# EAGLE design canbus_shield-v1 (EAGLE 6.2)
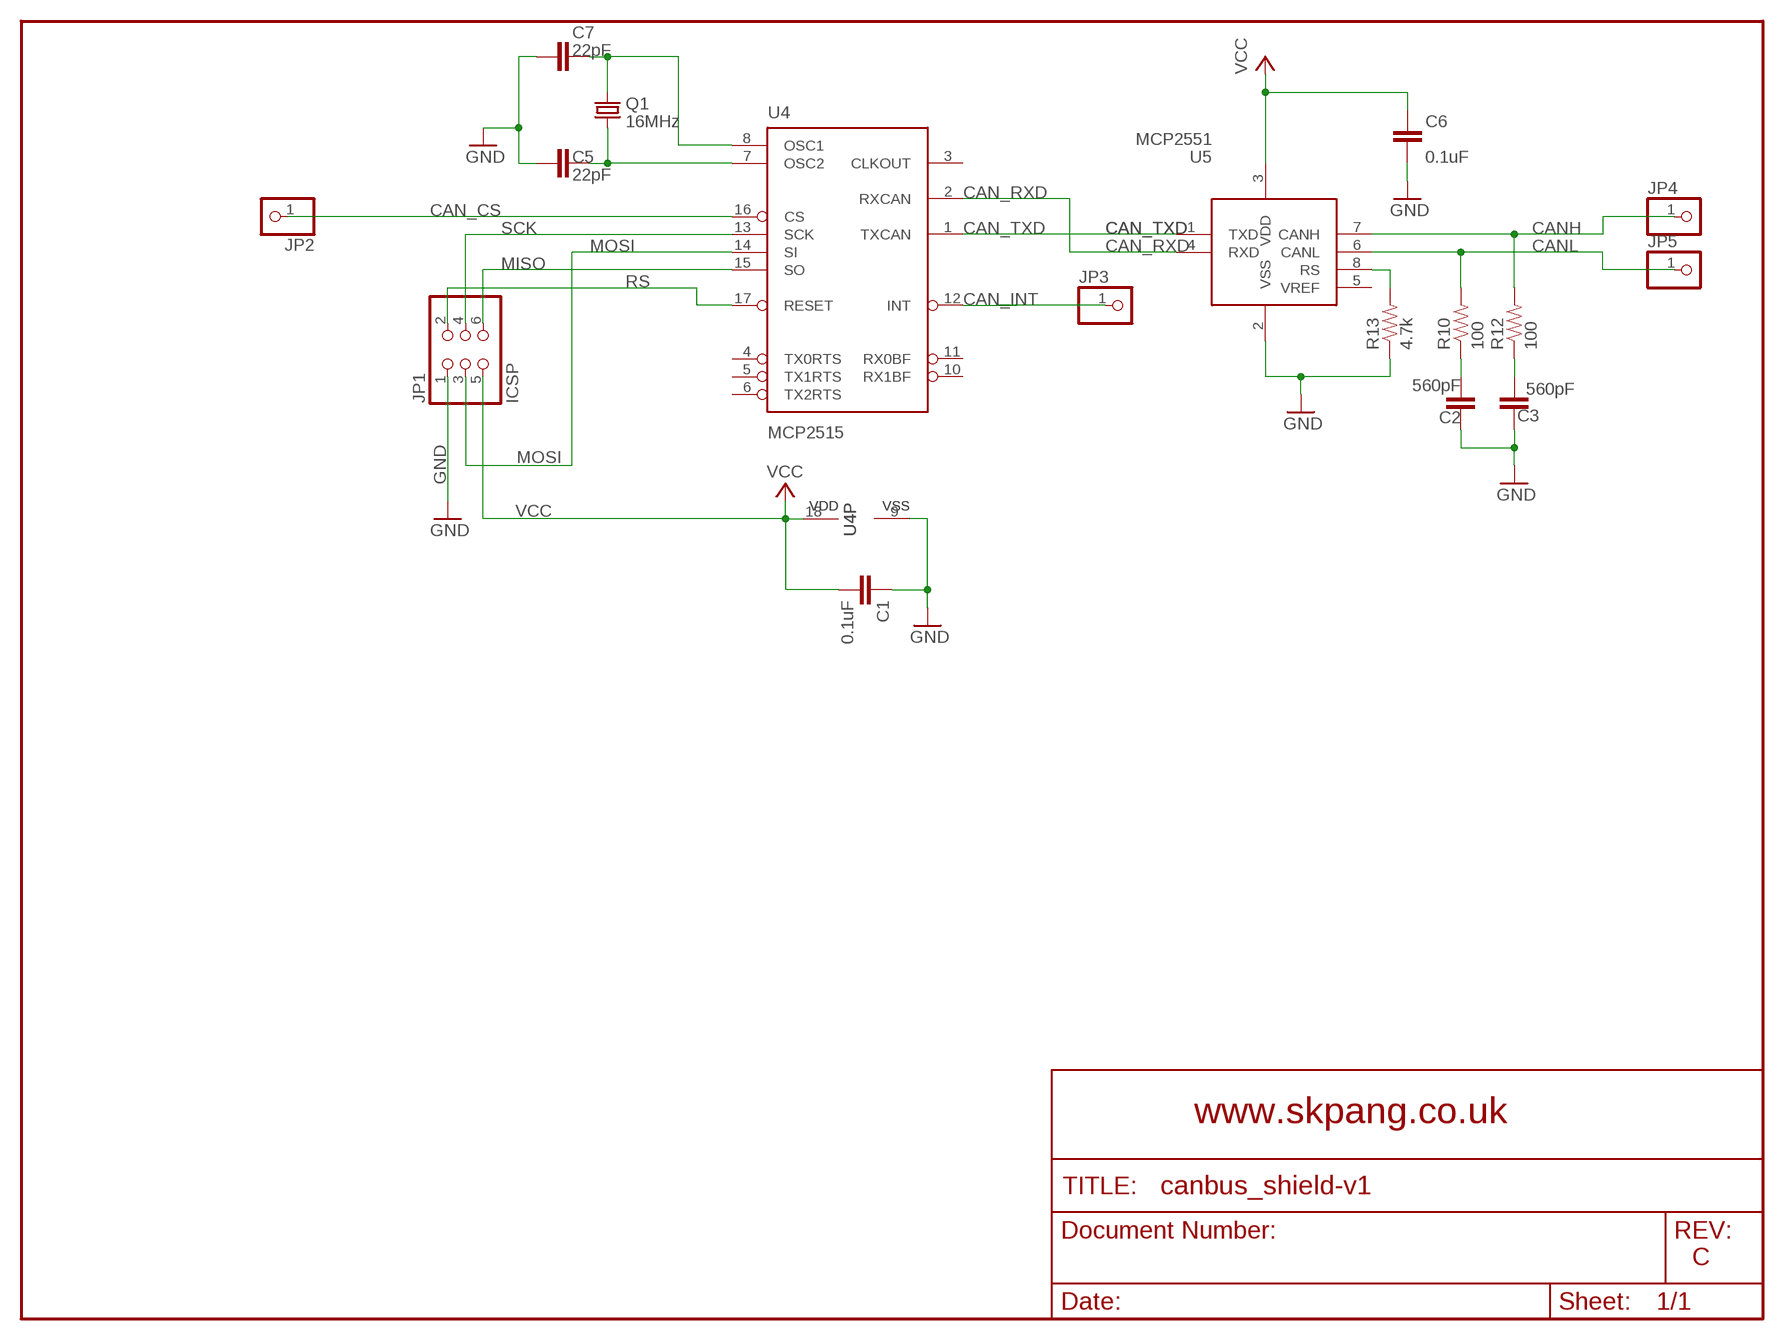
[diagram p0: schematic, sheet 1]

## Parts
C1  0.1uF  CAP0603-CAP  [0603-CAP]
C2  560pF  CAP0603-CAP  [0603-CAP]
C3  560pF  CAP0603-CAP  [0603-CAP]
C5  22pF  CAP0603-CAP  [0603-CAP]
C6  0.1uF  CAP0603-CAP  [0603-CAP]
C7  22pF  CAP0603-CAP  [0603-CAP]
JP1  ICSP  PINHD-2X3  [2X03]
JP2  PINHD-1X1  [1X01]
JP3  PINHD-1X1  [1X01]
JP4  PINHD-1X1  [1X01]
JP5  PINHD-1X1  [1X01]
Q1  16MHz  CRYSTAL5X3  [CRYSTAL-SMD-5X3]
R10  100  RESISTOR0603-RES  [0603-RES]
R12  100  RESISTOR0603-RES  [0603-RES]
R13  4.7k  RESISTOR0603-RES  [0603-RES]
U4  MCP2515  MCP2510SO  [SO-18W]
U5  MCP2551  [SO-08M]

## Nets
CAN_CS: JP2.1 U4.16(CS)
CAN_INT: JP3.1 U4.12(INT)
CAN_RXD: U4.2(RXCAN) U5.4(RXD)
CAN_TXD: U4.1(TXCAN) U5.1(TXD)
CANH: JP4.1 R12.2 U5.7(CANH)
CANL: JP5.1 R10.2 U5.6(CANL)
GND: C1.1 C2.1 C3.1 C5.1 C6.1 C7.1 JP1.1 R13.1 U4.9(VSS) U5.2(VSS)
MISO: JP1.6 U4.15(SO)
MOSI: JP1.3 U4.14(SI)
N$9: C2.2 R10.1
N$10: C3.2 R12.1
N$14: R13.2 U5.8(RS)
N$17: C7.2 Q1.3 U4.8(OSC1)
N$18: C5.2 Q1.1 U4.7(OSC2)
RS: JP1.2 U4.17(RESET)
SCK: JP1.4 U4.13(SCK)
VCC: C1.2 C6.2 JP1.5 U4.18(VDD) U5.3(VDD)
Unconnected: U4.3(CLKOUT) U4.4(TX0RTS) U4.5(TX1RTS) U4.6(TX2RTS) U4.10(RX1BF) U4.11(RX0BF) U5.5(VREF)

## Notes on the sheet
- www.skpang.co.uk
- C

## Library data of the parts
C1-C3 C5-C7 = SparkFun:CAP: Capacitor Standard 0603 ceramic capacitor, and 0.1" leaded capacitor.
JP1 = pinhead:PINHD-2X3: PIN HEADER
JP2-JP5 = pinhead:PINHD-1X1: PIN HEADER
Q1 = SparkFun:CRYSTAL: Crystals Various standard crystals. Proven footprints. Spark Fun Electronics SKU : COM-00534
R10 R12 R13 = SparkFun:RESISTOR: Resistor Basic schematic elements and footprints for 0603, 1206, and PTH resistors.
U4 = microchip_can:MCP2510
U5 = skpang_lib:MCP2551

## Net classes
0 default: width 0.18 mm, drill 0.3 mm, clearance 0.15 mm

## Board
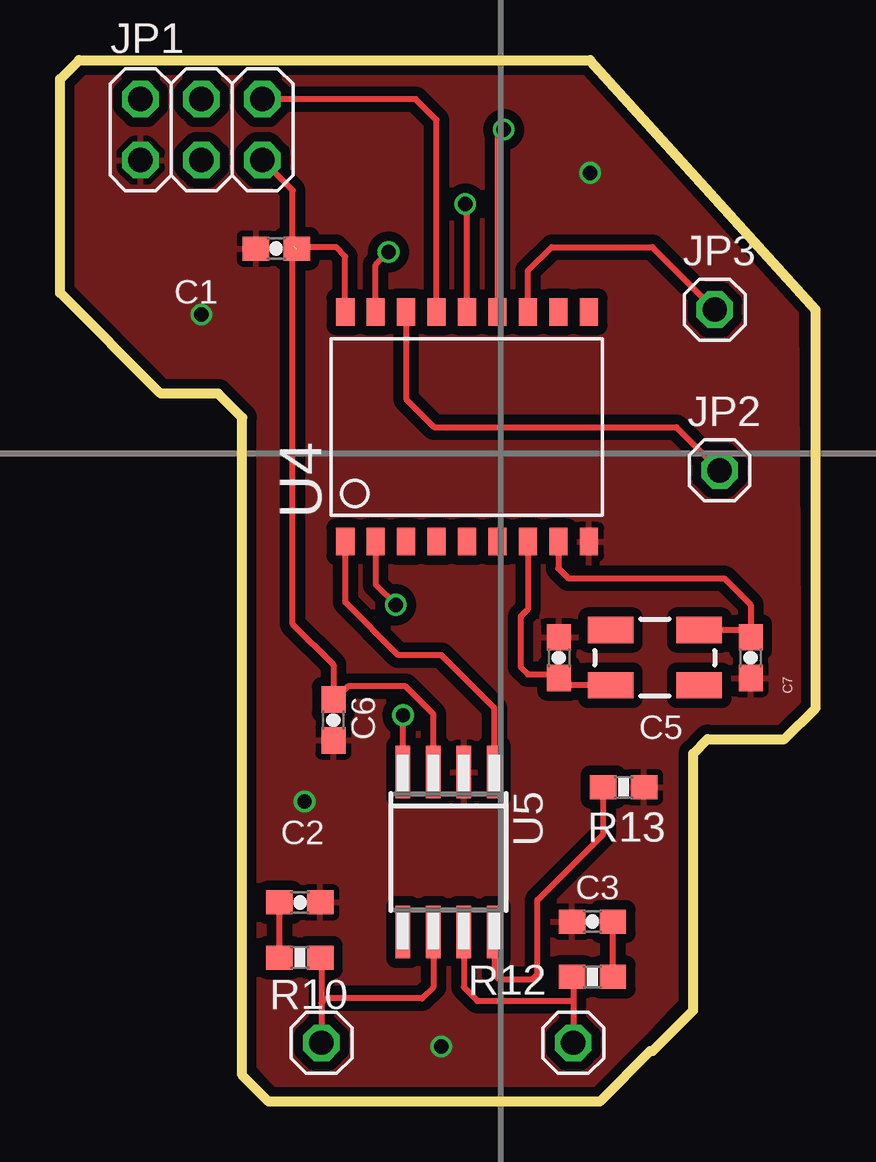
[diagram p1: board, top side]
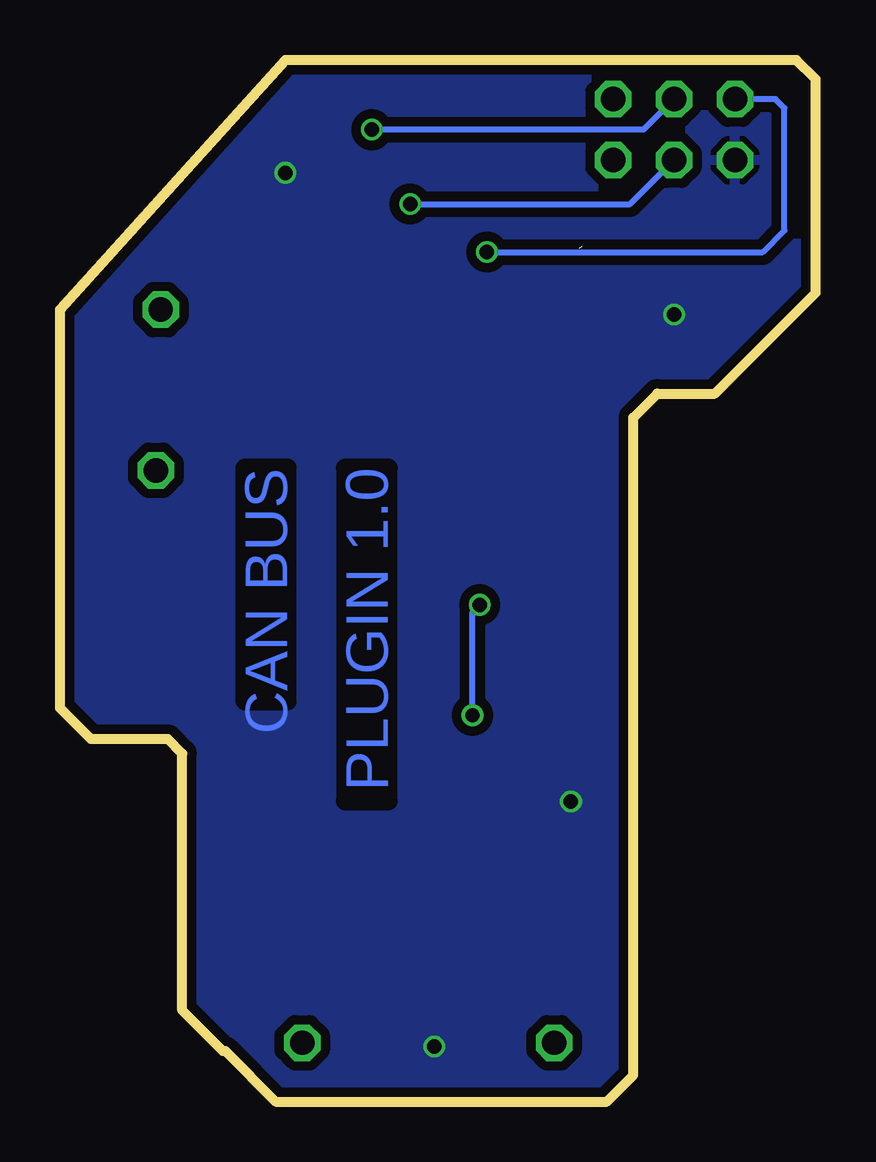
[diagram p2: board, bottom side, seen from below]

Size 31.5 x 43.4 mm. Coordinates in mm from the lower left corner, seen from the top.
Outline: 24.6,2.1 22.5,0 8.7,0 7.6,1.1 7.6,28.5 6.6,29.5 4.2,29.5 0,33.7 0,42.6 0.8,43.4 22.1,43.4 31.5,33 31.5,16.4 30.2,15.1 27,15.1 26.4,14.5 26.4,3.8 24.7,2.1
Copper layers (1*16): Top 0.035mm / dielectric 1.5mm / Bottom 0.035mm
Design rules "default": minimum track width 6mil, minimum drill 12mil, track to track 6mil, track to pad 6mil, pad to pad 6mil, via to via 6mil, smd to smd 0mil, copper to edge 10mil, drill to drill 10mil, minimum pad ring 10mil, minimum via ring 6mil, stop-mask expansion 2mil, vias tented up to drill 100mil, thermal gap 10mil

### Footprints (pad centres in the part's own frame; a part is rotated, then mirrored left to right if it is on the bottom)
0603-CAP = smd 1.1 x 1: 1 -0.85,0; 2 0.85,0
2X03 = drill 1.016 octagon: 1 -2.54,-1.27; 2 -2.54,1.27; 3 0,-1.27; 4 0,1.27; 5 2.54,-1.27; 6 2.54,1.27
1X01 = drill 1.016 octagon: 1 0,0
CRYSTAL-SMD-5X3 = smd 1.9 x 1.1: 1 -1.85,-1.15; 2 1.85,-1.15; 3 1.85,1.15; 4 -1.85,1.15
0603-RES = smd 1.1 x 1: 1 -0.85,0; 2 0.85,0
SO-18W = smd 0.762 x 1.143: 1 -5.08,-4.788; 2 -3.81,-4.788; 3 -2.54,-4.788; 4 -1.27,-4.788; 5 0,-4.788; 6 1.27,-4.788; 7 2.54,-4.788; 8 3.81,-4.788; 9 5.08,-4.788; 10 5.08,4.788; 11 3.81,4.788; 12 2.54,4.788; 13 1.27,4.788; 14 0,4.788; 15 -1.27,4.788; 16 -2.54,4.788; 17 -3.81,4.788; 18 -5.08,4.788
SO-08M = smd 0.6 x 2.2: 1 -1.905,-3.33; 2 -0.635,-3.33; 3 0.635,-3.33; 4 1.905,-3.33; 5 1.905,3.33; 6 0.635,3.33; 7 -0.635,3.33; 8 -1.905,3.33

### Placement (x,y rotation side)
C1  9.02,35.54 0 top
C2  10,8.3 180 top
C3  22.2,7.5 0 top
C5  20.8,18.5 270 top
C6  11.4,15.9 90 top
C7  28.8,18.5 90 top
JP1  5.9,40.5 0 top
JP2  27.5,26.3 0 top
JP3  27.3,33 0 top
JP4  21.4,2.45 0 top
JP5  10.9,2.45 0 top
Q1  24.8,18.5 0 top
R10  10,6 0 top
R12  22.2,5.2 180 top
R13  23.5,13.1 180 top
U4  16.97,28.12 0 top
U5  16.2,10.4 180 top

### Tracks (layer width: path | path; a pad name or v marks a point on that pad's centre or on a via)
CAN_CS
  Top 0.254: U4.16 14.43,29.27 15.6,28.1 25.7,28.1 JP2.1
CAN_INT
  Top 0.254: U4.12 19.51,34.61 20.5,35.6 24.7,35.6 JP3.1
CAN_RXD  (via drill 0.6)
  Top 0.254: U5.4 v14.29,16.1 v14.3,16.1 | U4.2 13.16,21.54 v14,20.7
  Bottom 0.254: v14.3,16.1 14.3,20.4 v14,20.7
CAN_TXD
  Top 0.254: U5.1 18.11,16.39 15.9,18.6 14.1,18.6 11.9,20.8 U4.1
CANH
  Top 0.254: R12.2 21.4,5.15 21.4,4.2 | 21.4,4.2 JP4.1 | U5.7 16.84,4.76 17.4,4.2 21.4,4.2
CANL
  Top 0.254: U5.6 15.56,4.76 15.1,4.3 11.1,4.3 10.9,4.1 | 10.9,4.1 JP5.1 | R10.2 10.9,5.95 10.9,4.1
GND  (via drill 0.6)
  other vias: 5.9,32.8 22.1,38.7 15.9,2.3 10.2,12.5
  pour Top (isolate 0.4): 8.3,1.5 9,0.7 22.2,0.7 24.3,2.8 25.3,3.9 25.8,4.4 25.8,14.7 26.8,15.7 30,15.7 30.8,16.5 30.7,33.1 30.1,33.7 21.9,42.7 1.1,42.8 0.5,42.2 0.6,34.1 4.4,30 4.5,30.1 6.9,30.1 8.2,28.8 8.2,28.7
  pour Bottom (isolate 0.4): 23.9,2.3 25.7,4.1 25.7,13.1 25.7,14.8 26.7,15.8 29.9,15.8 30.8,16.7 30.8,33.5 21.7,42.6 1.1,42.6 0.8,42.3 0.8,33.9 4.5,30.2 6.9,30.2 8.3,28.8 8.3,1.4 9.1,0.6 22.2,0.6 23.8,2.2
MISO
  Top 0.254: U4.15 15.7,40.9 14.83,41.77 JP1.6
MOSI  (via drill 0.6)
  Top 0.254: U4.14 16.97,37.33 v16.9,37.4
  Bottom 0.254: v16.9,37.4 7.73,37.4 JP1.3
N$9
  Top 0.254: R10.1 C2.2
N$10
  Top 0.254: R12.1 C3.2
N$14
  Top 0.254: U5.8 18.11,5.29 18.3,5.1 19.7,5.1 19.9,5.3 19.9,8.4 22.65,11.15 R13.2
N$17
  Top 0.254: Q1.3 28.5,19.65 C7.2 28.8,20.7 27.7,21.8 21.2,21.8 20.78,22.22 U4.8
N$18
  Top 0.254: Q1.1 21.1,17.35 C5.2 20.65,17.8 19.5,17.8 19.2,18.1 19.2,20.2 19.51,20.51 U4.7
RS  (via drill 0.6)
  Top 0.254: U4.17 13.16,34.86 v13.7,35.4
  Bottom 0.254: v13.7,35.4 2.2,35.4 1.3,36.3 1.3,41.4 1.67,41.77 JP1.2
SCK  (via drill 0.6)
  Top 0.254: v18.5,40.5 18.24,40.24 U4.13
  Bottom 0.254: JP1.4 7.17,40.5 v18.5,40.5
VCC  (1 unrouted)
  Top 0.254: JP1.5 9.7,37.97 9.7,35.6 | 9.7,35.6 9.7,19.9 11.4,18.2 C6.2 11.4,16.7 12,17.3 14.4,17.3 15.56,16.14 U5.3 | 9.73,35.63 9.7,35.6 | U4.18 11.89,35.21 11.5,35.6 9.93,35.6 C1.2

### Text on the board
Bottom: PLUGIN 1.0 | CAN BUS